# Altium schematic sheet BarrelNBattery.SchDoc
size A; SheetNumber: 2; SheetTotal: 2
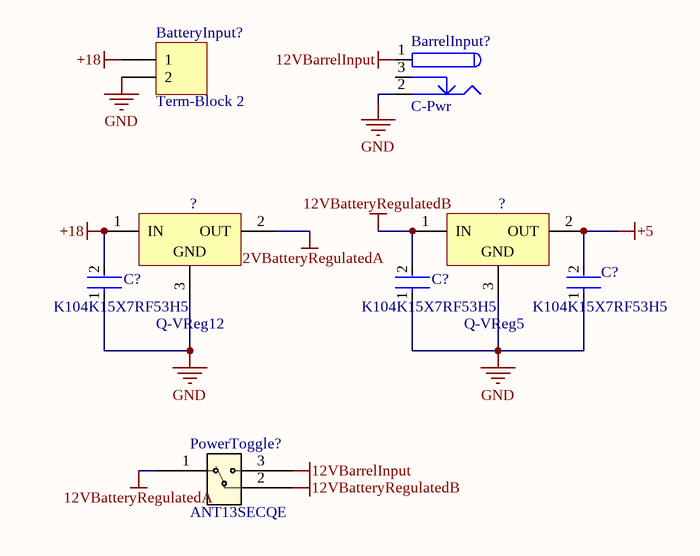
[diagram p0: BarrelNBattery.SchDoc]

## Parts
(Parts that share a designator on the sheet are numbered #1, #2 ... from top to bottom, then left to right.)
?#1  Q-VReg12  [TO220_XLGE1.2]
?#2  Q-VReg5  [TO220_XLGE1.2]
BarrelInput?  C-Pwr  [KLD_XLGE1.2]
BatteryInput?  Term-Block 2  [TERM-BLOCK-5.08MM-2POS]
C?#1  K104K15X7RF53H5  [FP-K15H5-MFG]
C?#2  K104K15X7RF53H5  [FP-K15H5-MFG]
C?#3  K104K15X7RF53H5  [FP-K15H5-MFG]
PowerToggle?  ANT13SECQE  [ANT13SEC_CRS]

## Nets
12VBarrelInput: BarrelInput?.1 PowerToggle?.3
12VBatteryRegulatedA: ?#1.2(OUT) PowerToggle?.1
12VBatteryRegulatedB: ?#2.1(IN) C?#2.2 PowerToggle?.2
+5: ?#2.2(OUT) C?#3.2
+18: ?#1.1(IN) BatteryInput?.1 C?#1.2
GND: ?#1.3(GND) ?#2.3(GND) BarrelInput?.2 BatteryInput?.2 C?#1.1 C?#2.1 C?#3.1

Not connected (* = marked no-connect by the designer): BarrelInput? 3

## Library data of the parts
?#1 = Q-VReg12: voltage reg (12V); ComponentLink1URL: https://www.fairchildsemi.com/datasheets/LM/LM7805.pdf; ComponentLink1Description: Datasheet (ELEC391)
?#2 = Q-VReg5: voltage reg (5V); Published: 15-Apr-2002; DatasheetVersion: Oct-1999; PackageVersion: 1996; PackageReference: 29-04; Publisher: Altium Limited; PackageDescription: TO, Flat Index; 3 In-Line, Axial Leads; Body Dia. 4.8mm; Leads 0.48 x 0.51 mm (max); ComponentLink1Description: Manufacturer Link; ComponentLink1URL: http://www.onsemi.com/site/products/taxonomy/0,4438,503,00.html; ComponentLink2Description: Datasheet; ComponentLink2URL: http://www.onsemi.com/pub/Collateral/MC78L00A-D.PDF; ComponentLink3URL: https://www.fairchildsemi.com/datasheets/LM/LM7805.pdf; ComponentLink3Description: Datasheet (ELEC391)
BarrelInput? = C-Pwr: Low Voltage Power Supply Connector; Published: 17-Dec-2003; DatasheetDocument: 09-May-2002; Publisher: Altium Limited; ComponentLink1Description: Manufacturer Link; ComponentLink1URL: http://domino.kycon.com/internet/Products.html; ComponentLink2URL: http://www.cui.com/product/resource/pj-102a.pdf; ComponentLink2Description: Datasheet (ELEC391)
BatteryInput? = C-Block2: Terminal-Block 1x2; LatestRevisionDate: 17-Jul-2002; LatestRevisionNote: Re-released for DXP Platform.; Publisher: Altium Limited
C?#1-C?#3 = CMP-02417-000048-1: CAP CER 0.1UF 50V X7R RADIAL; Capacitance: 100nF; Tolerance: 10%; Lead/Base Style: Formed Leads; Lead Length: 30mm; Lead Diameter: 0.5mm; Radiation Hardening: No; Lead Pitch: 5mm; Voltage: 50V; Mount: Through Hole; Package Quantity: 5000; Series: K; Case/Package: Dipped; Min Operating Temperature: -55°C; Depth: 2.5mm; Height - Seated (Max): 0.1inch; Voltage Rating (DC): 50V; Packaging: Bulk; RoHS Compliant: Yes; Construction: RADIAL; Thickness: 2.6mm; Max Operating Temperature: 125°C; Voltage Rating: 50V; Diameter: 500um; Dielectric: X7R; Width: 2.5mm; Length: 4mm; Weight: 0.005644oz; Termination: Radial; Height: 4mm
PowerToggle? = ANT13SECQE: No Description Available; Mfr_Name: CIT Relay & Switch; Type: Toggle Switches; RefDes: RefDes